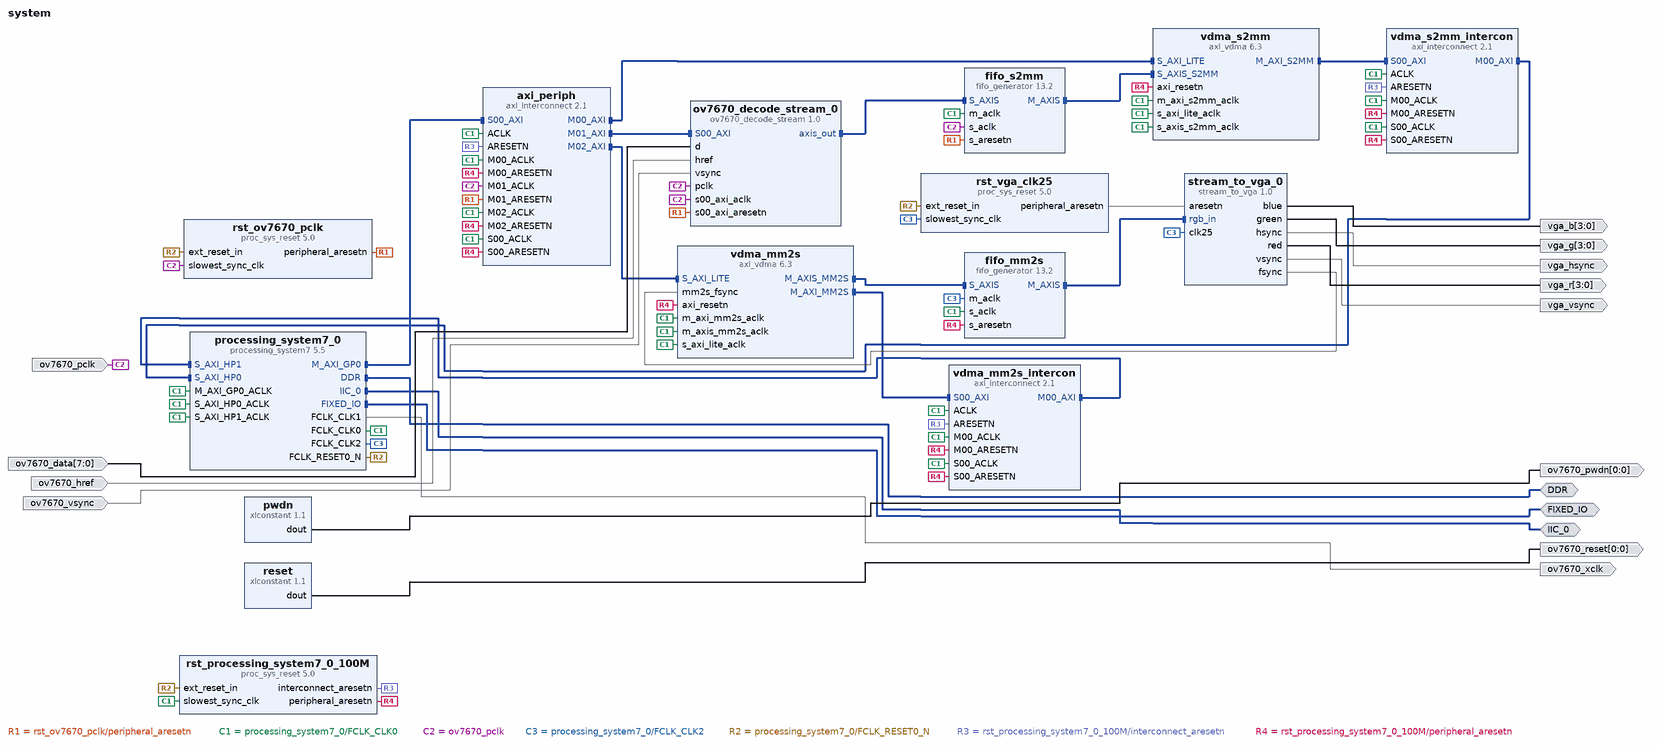
[diagram p0: block diagram of the top level]
# Vivado block design system, xc7z020clg484-1, Vivado 2019.1
create_bd_design system

create_bd_intf_port -mode Master -vlnv xilinx.com:interface:ddrx_rtl:1.0 DDR
create_bd_intf_port -mode Master -vlnv xilinx.com:display_processing_system7:fixedio_rtl:1.0 FIXED_IO
create_bd_intf_port -mode Master -vlnv xilinx.com:interface:iic_rtl:1.0 IIC_0
create_bd_port -dir I -from 7 -to 0 ov7670_data
create_bd_port -dir I ov7670_href
create_bd_port -dir I ov7670_pclk
create_bd_port -dir O -from 0 -to 0 ov7670_pwdn
create_bd_port -dir O -from 0 -to 0 ov7670_reset
create_bd_port -dir I ov7670_vsync
create_bd_port -dir O -type clk ov7670_xclk
create_bd_port -dir O -from 3 -to 0 vga_b
create_bd_port -dir O -from 3 -to 0 vga_g
create_bd_port -dir O vga_hsync
create_bd_port -dir O -from 3 -to 0 vga_r
create_bd_port -dir O vga_vsync

create_bd_cell -type ip -vlnv xilinx.com:ip:axi_interconnect:2.1 axi_periph
set_property -dict {CONFIG.NUM_MI 3} [get_bd_cells axi_periph]
create_bd_cell -type ip -vlnv xilinx.com:ip:fifo_generator:13.2 fifo_mm2s
set_property -dict [list \
  CONFIG.Clock_Type_AXI Independent_Clock \
  CONFIG.Enable_TLAST true \
  CONFIG.FIFO_Implementation_axis Independent_Clocks_Block_RAM \
  CONFIG.FIFO_Implementation_rach Independent_Clocks_Distributed_RAM \
  CONFIG.FIFO_Implementation_rdch Independent_Clocks_Block_RAM \
  CONFIG.FIFO_Implementation_wach Independent_Clocks_Distributed_RAM \
  CONFIG.FIFO_Implementation_wdch Independent_Clocks_Block_RAM \
  CONFIG.FIFO_Implementation_wrch Independent_Clocks_Distributed_RAM \
  CONFIG.Full_Flags_Reset_Value 1 \
  CONFIG.INTERFACE_TYPE AXI_STREAM \
  CONFIG.TDATA_NUM_BYTES 2 \
  CONFIG.TUSER_WIDTH 1 \
  CONFIG.synchronization_stages_axi 4 \
] [get_bd_cells fifo_mm2s]
create_bd_cell -type ip -vlnv xilinx.com:ip:fifo_generator:13.2 fifo_s2mm
set_property -dict [list \
  CONFIG.Clock_Type_AXI Independent_Clock \
  CONFIG.Enable_TLAST true \
  CONFIG.FIFO_Implementation_axis Independent_Clocks_Block_RAM \
  CONFIG.FIFO_Implementation_rach Independent_Clocks_Distributed_RAM \
  CONFIG.FIFO_Implementation_rdch Independent_Clocks_Block_RAM \
  CONFIG.FIFO_Implementation_wach Independent_Clocks_Distributed_RAM \
  CONFIG.FIFO_Implementation_wdch Independent_Clocks_Block_RAM \
  CONFIG.FIFO_Implementation_wrch Independent_Clocks_Distributed_RAM \
  CONFIG.Full_Flags_Reset_Value 1 \
  CONFIG.INTERFACE_TYPE AXI_STREAM \
  CONFIG.TDATA_NUM_BYTES 2 \
  CONFIG.TUSER_WIDTH 1 \
  CONFIG.synchronization_stages_axi 4 \
] [get_bd_cells fifo_s2mm]
create_bd_cell -type ip -vlnv user.org:user:ov7670_decode_stream:1.0 ov7670_decode_stream_0
create_bd_cell -type ip -vlnv xilinx.com:ip:processing_system7:5.5 processing_system7_0
set_property -dict [list \
  CONFIG.PCW_APU_PERIPHERAL_FREQMHZ 666.666667 \
  CONFIG.PCW_ENET0_ENET0_IO {MIO 16 .. 27} \
  CONFIG.PCW_ENET0_GRP_MDIO_ENABLE 1 \
  CONFIG.PCW_ENET0_GRP_MDIO_IO {MIO 52 .. 53} \
  CONFIG.PCW_ENET0_PERIPHERAL_ENABLE 1 \
  CONFIG.PCW_ENET0_RESET_ENABLE 0 \
  CONFIG.PCW_ENET_RESET_ENABLE 1 \
  CONFIG.PCW_ENET_RESET_SELECT {Share reset pin} \
  CONFIG.PCW_EN_CLK1_PORT 1 \
  CONFIG.PCW_EN_CLK2_PORT 1 \
  CONFIG.PCW_FCLK_CLK1_BUF TRUE \
  CONFIG.PCW_FCLK_CLK2_BUF TRUE \
  CONFIG.PCW_FPGA0_PERIPHERAL_FREQMHZ 100.000000 \
  CONFIG.PCW_FPGA1_PERIPHERAL_FREQMHZ 25 \
  CONFIG.PCW_FPGA2_PERIPHERAL_FREQMHZ 25 \
  CONFIG.PCW_FPGA_FCLK1_ENABLE 1 \
  CONFIG.PCW_FPGA_FCLK2_ENABLE 1 \
  CONFIG.PCW_GPIO_MIO_GPIO_ENABLE 1 \
  CONFIG.PCW_GPIO_MIO_GPIO_IO MIO \
  CONFIG.PCW_I2C0_I2C0_IO EMIO \
  CONFIG.PCW_I2C0_PERIPHERAL_ENABLE 1 \
  CONFIG.PCW_I2C_PERIPHERAL_FREQMHZ 111.111115 \
  CONFIG.PCW_I2C_RESET_ENABLE 1 \
  CONFIG.PCW_I2C_RESET_SELECT {Share reset pin} \
  CONFIG.PCW_PRESET_BANK1_VOLTAGE {LVCMOS 1.8V} \
  CONFIG.PCW_QSPI_GRP_SINGLE_SS_ENABLE 1 \
  CONFIG.PCW_QSPI_GRP_SINGLE_SS_IO {MIO 1 .. 6} \
  CONFIG.PCW_QSPI_PERIPHERAL_ENABLE 1 \
  CONFIG.PCW_QSPI_PERIPHERAL_FREQMHZ 200.000000 \
  CONFIG.PCW_QSPI_QSPI_IO {MIO 1 .. 6} \
  CONFIG.PCW_SD0_GRP_CD_ENABLE 1 \
  CONFIG.PCW_SD0_GRP_CD_IO {MIO 47} \
  CONFIG.PCW_SD0_GRP_WP_ENABLE 1 \
  CONFIG.PCW_SD0_GRP_WP_IO {MIO 46} \
  CONFIG.PCW_SD0_PERIPHERAL_ENABLE 1 \
  CONFIG.PCW_SD0_SD0_IO {MIO 40 .. 45} \
  CONFIG.PCW_SDIO_PERIPHERAL_FREQMHZ 50 \
  CONFIG.PCW_SINGLE_QSPI_DATA_MODE x4 \
  CONFIG.PCW_TTC0_PERIPHERAL_ENABLE 1 \
  CONFIG.PCW_TTC0_TTC0_IO EMIO \
  CONFIG.PCW_UART1_PERIPHERAL_ENABLE 1 \
  CONFIG.PCW_UART1_UART1_IO {MIO 48 .. 49} \
  CONFIG.PCW_UART_PERIPHERAL_FREQMHZ 50 \
  CONFIG.PCW_UIPARAM_DDR_FREQ_MHZ 533.333313 \
  CONFIG.PCW_UIPARAM_DDR_PARTNO {MT41J128M16 HA-15E} \
  CONFIG.PCW_USB0_PERIPHERAL_ENABLE 1 \
  CONFIG.PCW_USB0_RESET_ENABLE 0 \
  CONFIG.PCW_USB0_USB0_IO {MIO 28 .. 39} \
  CONFIG.PCW_USB_RESET_ENABLE 1 \
  CONFIG.PCW_USB_RESET_SELECT {Share reset pin} \
  CONFIG.PCW_USE_S_AXI_HP0 1 \
  CONFIG.PCW_USE_S_AXI_HP1 1 \
  CONFIG.preset ZedBoard \
] [get_bd_cells processing_system7_0]
# 224 more settings of processing_system7_0 are not shown: defaults, MIO pin electricals, DDR timing, and values the tool derives
create_bd_cell -type ip -vlnv xilinx.com:ip:xlconstant:1.1 pwdn
set_property -dict {CONFIG.CONST_VAL 0} [get_bd_cells pwdn]
create_bd_cell -type ip -vlnv xilinx.com:ip:xlconstant:1.1 reset
create_bd_cell -type ip -vlnv xilinx.com:ip:proc_sys_reset:5.0 rst_ov7670_pclk
create_bd_cell -type ip -vlnv xilinx.com:ip:proc_sys_reset:5.0 rst_processing_system7_0_100M
create_bd_cell -type ip -vlnv xilinx.com:ip:proc_sys_reset:5.0 rst_vga_clk25
create_bd_cell -type ip -vlnv user.org:user:stream_to_vga:1.0 stream_to_vga_0
create_bd_cell -type ip -vlnv xilinx.com:ip:axi_vdma:6.3 vdma_mm2s
set_property -dict [list \
  CONFIG.c_include_mm2s 1 \
  CONFIG.c_include_s2mm 0 \
  CONFIG.c_m_axis_mm2s_tdata_width 16 \
  CONFIG.c_mm2s_genlock_mode 2 \
  CONFIG.c_mm2s_linebuffer_depth 1024 \
  CONFIG.c_mm2s_max_burst_length 256 \
  CONFIG.c_num_fstores 1 \
  CONFIG.c_use_mm2s_fsync 1 \
] [get_bd_cells vdma_mm2s]
create_bd_cell -type ip -vlnv xilinx.com:ip:axi_interconnect:2.1 vdma_mm2s_intercon
set_property -dict {CONFIG.NUM_MI 1} [get_bd_cells vdma_mm2s_intercon]
create_bd_cell -type ip -vlnv xilinx.com:ip:axi_vdma:6.3 vdma_s2mm
set_property -dict [list \
  CONFIG.c_include_mm2s 0 \
  CONFIG.c_num_fstores 1 \
  CONFIG.c_s2mm_linebuffer_depth 1024 \
  CONFIG.c_s2mm_max_burst_length 256 \
] [get_bd_cells vdma_s2mm]
create_bd_cell -type ip -vlnv xilinx.com:ip:axi_interconnect:2.1 vdma_s2mm_intercon
set_property -dict {CONFIG.NUM_MI 1} [get_bd_cells vdma_s2mm_intercon]

# ---- connections ----

connect_bd_intf_net [get_bd_intf_pins fifo_s2mm/S_AXIS] [get_bd_intf_pins ov7670_decode_stream_0/axis_out]
connect_bd_intf_net [get_bd_intf_ports DDR] [get_bd_intf_pins processing_system7_0/DDR]
connect_bd_intf_net -intf_net fifo_generator_0_M_AXIS [get_bd_intf_pins fifo_s2mm/M_AXIS] [get_bd_intf_pins vdma_s2mm/S_AXIS_S2MM]
connect_bd_intf_net -intf_net axi_mem_intercon_M00_AXI1 [get_bd_intf_pins processing_system7_0/S_AXI_HP1] [get_bd_intf_pins vdma_mm2s_intercon/M00_AXI]
connect_bd_intf_net -intf_net axi_vdma_1_M_AXIS_MM2S [get_bd_intf_pins fifo_mm2s/S_AXIS] [get_bd_intf_pins vdma_mm2s/M_AXIS_MM2S]
connect_bd_intf_net -intf_net axi_mem_intercon_M00_AXI [get_bd_intf_pins processing_system7_0/S_AXI_HP0] [get_bd_intf_pins vdma_s2mm_intercon/M00_AXI]
connect_bd_intf_net [get_bd_intf_pins axi_periph/M00_AXI] [get_bd_intf_pins vdma_s2mm/S_AXI_LITE]
connect_bd_intf_net [get_bd_intf_pins axi_periph/M02_AXI] [get_bd_intf_pins vdma_mm2s/S_AXI_LITE]
connect_bd_intf_net [get_bd_intf_pins fifo_mm2s/M_AXIS] [get_bd_intf_pins stream_to_vga_0/rgb_in]
connect_bd_intf_net -intf_net axi_vdma_1_M_AXI_MM2S [get_bd_intf_pins vdma_mm2s/M_AXI_MM2S] [get_bd_intf_pins vdma_mm2s_intercon/S00_AXI]
connect_bd_intf_net [get_bd_intf_pins axi_periph/M01_AXI] [get_bd_intf_pins ov7670_decode_stream_0/S00_AXI]
connect_bd_intf_net -intf_net axi_vdma_0_M_AXI_S2MM [get_bd_intf_pins vdma_s2mm/M_AXI_S2MM] [get_bd_intf_pins vdma_s2mm_intercon/S00_AXI]
connect_bd_intf_net [get_bd_intf_pins axi_periph/S00_AXI] [get_bd_intf_pins processing_system7_0/M_AXI_GP0]
connect_bd_intf_net [get_bd_intf_ports IIC_0] [get_bd_intf_pins processing_system7_0/IIC_0]
connect_bd_intf_net [get_bd_intf_ports FIXED_IO] [get_bd_intf_pins processing_system7_0/FIXED_IO]
connect_bd_net -net M01_ARESETN_1 [get_bd_pins rst_ov7670_pclk/peripheral_aresetn] \
  [get_bd_pins axi_periph/M01_ARESETN] [get_bd_pins fifo_s2mm/s_aresetn] [get_bd_pins ov7670_decode_stream_0/s00_axi_aresetn]
connect_bd_net -net d_1 [get_bd_ports ov7670_data] [get_bd_pins ov7670_decode_stream_0/d]
connect_bd_net -net href_1 [get_bd_ports ov7670_href] [get_bd_pins ov7670_decode_stream_0/href]
connect_bd_net -net microblaze_0_Clk [get_bd_pins processing_system7_0/FCLK_CLK0] \
  [get_bd_pins axi_periph/ACLK] [get_bd_pins axi_periph/M00_ACLK] [get_bd_pins axi_periph/M02_ACLK] \
  [get_bd_pins axi_periph/S00_ACLK] [get_bd_pins fifo_mm2s/s_aclk] [get_bd_pins fifo_s2mm/m_aclk] \
  [get_bd_pins processing_system7_0/M_AXI_GP0_ACLK] [get_bd_pins processing_system7_0/S_AXI_HP0_ACLK] \
  [get_bd_pins processing_system7_0/S_AXI_HP1_ACLK] [get_bd_pins rst_processing_system7_0_100M/slowest_sync_clk] \
  [get_bd_pins vdma_mm2s/m_axi_mm2s_aclk] [get_bd_pins vdma_mm2s/m_axis_mm2s_aclk] [get_bd_pins vdma_mm2s/s_axi_lite_aclk] \
  [get_bd_pins vdma_mm2s_intercon/ACLK] [get_bd_pins vdma_mm2s_intercon/M00_ACLK] [get_bd_pins vdma_mm2s_intercon/S00_ACLK] \
  [get_bd_pins vdma_s2mm/m_axi_s2mm_aclk] [get_bd_pins vdma_s2mm/s_axi_lite_aclk] [get_bd_pins vdma_s2mm/s_axis_s2mm_aclk] \
  [get_bd_pins vdma_s2mm_intercon/ACLK] [get_bd_pins vdma_s2mm_intercon/M00_ACLK] [get_bd_pins vdma_s2mm_intercon/S00_ACLK]
connect_bd_net -net pclk_1 [get_bd_ports ov7670_pclk] \
  [get_bd_pins axi_periph/M01_ACLK] [get_bd_pins fifo_s2mm/s_aclk] [get_bd_pins ov7670_decode_stream_0/pclk] \
  [get_bd_pins ov7670_decode_stream_0/s00_axi_aclk] [get_bd_pins rst_ov7670_pclk/slowest_sync_clk]
connect_bd_net [get_bd_pins processing_system7_0/FCLK_CLK1] [get_bd_ports ov7670_xclk]
connect_bd_net [get_bd_pins processing_system7_0/FCLK_CLK2] \
  [get_bd_pins fifo_mm2s/m_aclk] [get_bd_pins rst_vga_clk25/slowest_sync_clk] [get_bd_pins stream_to_vga_0/clk25]
connect_bd_net [get_bd_pins processing_system7_0/FCLK_RESET0_N] \
  [get_bd_pins rst_ov7670_pclk/ext_reset_in] [get_bd_pins rst_processing_system7_0_100M/ext_reset_in] \
  [get_bd_pins rst_vga_clk25/ext_reset_in]
connect_bd_net [get_bd_pins pwdn/dout] [get_bd_ports ov7670_pwdn]
connect_bd_net [get_bd_pins reset/dout] [get_bd_ports ov7670_reset]
connect_bd_net -net rst_ov7670_pclk1_peripheral_aresetn [get_bd_pins rst_vga_clk25/peripheral_aresetn] [get_bd_pins stream_to_vga_0/aresetn]
connect_bd_net [get_bd_pins rst_processing_system7_0_100M/interconnect_aresetn] \
  [get_bd_pins axi_periph/ARESETN] [get_bd_pins vdma_mm2s_intercon/ARESETN] [get_bd_pins vdma_s2mm_intercon/ARESETN]
connect_bd_net [get_bd_pins rst_processing_system7_0_100M/peripheral_aresetn] \
  [get_bd_pins axi_periph/M00_ARESETN] [get_bd_pins axi_periph/M02_ARESETN] [get_bd_pins axi_periph/S00_ARESETN] \
  [get_bd_pins fifo_mm2s/s_aresetn] [get_bd_pins vdma_mm2s/axi_resetn] [get_bd_pins vdma_mm2s_intercon/M00_ARESETN] \
  [get_bd_pins vdma_mm2s_intercon/S00_ARESETN] [get_bd_pins vdma_s2mm/axi_resetn] \
  [get_bd_pins vdma_s2mm_intercon/M00_ARESETN] [get_bd_pins vdma_s2mm_intercon/S00_ARESETN]
connect_bd_net [get_bd_pins stream_to_vga_0/blue] [get_bd_ports vga_b]
connect_bd_net [get_bd_pins stream_to_vga_0/fsync] [get_bd_pins vdma_mm2s/mm2s_fsync]
connect_bd_net [get_bd_pins stream_to_vga_0/green] [get_bd_ports vga_g]
connect_bd_net [get_bd_pins stream_to_vga_0/hsync] [get_bd_ports vga_hsync]
connect_bd_net [get_bd_pins stream_to_vga_0/red] [get_bd_ports vga_r]
connect_bd_net [get_bd_pins stream_to_vga_0/vsync] [get_bd_ports vga_vsync]
connect_bd_net -net vsync_1 [get_bd_ports ov7670_vsync] [get_bd_pins ov7670_decode_stream_0/vsync]

# ---- address map ----
assign_bd_address -offset 0x43000000 -range 64K -target_address_space [get_bd_addr_spaces processing_system7_0/Data] [get_bd_addr_segs vdma_mm2s/S_AXI_LITE/Reg]
assign_bd_address -offset 0x43010000 -range 64K -target_address_space [get_bd_addr_spaces processing_system7_0/Data] [get_bd_addr_segs vdma_s2mm/S_AXI_LITE/Reg]
assign_bd_address -offset 0x43C00000 -range 64K -target_address_space [get_bd_addr_spaces processing_system7_0/Data] [get_bd_addr_segs ov7670_decode_stream_0/S00_AXI/S00_AXI_reg]
assign_bd_address -offset 0x10000000 -range 256M -target_address_space [get_bd_addr_spaces vdma_mm2s/Data_MM2S] [get_bd_addr_segs processing_system7_0/S_AXI_HP1/HP1_DDR_LOWOCM]
assign_bd_address -offset 0x10000000 -range 256M -target_address_space [get_bd_addr_spaces vdma_s2mm/Data_S2MM] [get_bd_addr_segs processing_system7_0/S_AXI_HP0/HP0_DDR_LOWOCM]

validate_bd_design
save_bd_design
